# Altium project Power Converter 5V as TO-3 replacement.PrjPcb
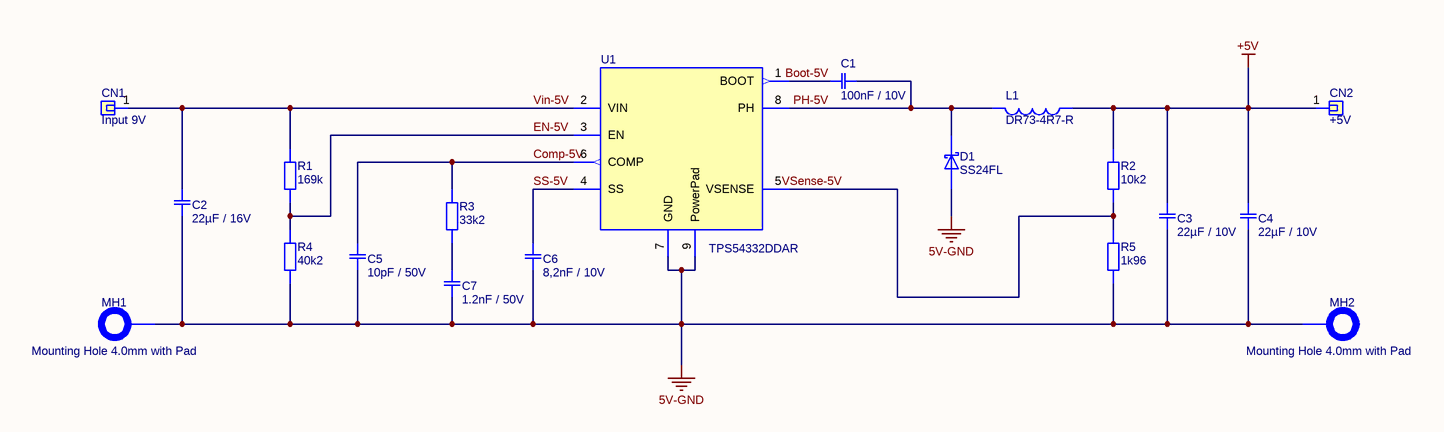
[diagram p0: Power Converter 5V as TO-3 replacement.SchDoc]
Author: PCB-Tech; Revision: A; Title: Projektname; Version: 1.0
1 sheet, 19 parts. Net scope: global (net labels, ports and power ports of the same name join across sheets).
Board file: Power Converter 5V as TO-3 replacement.PcbDoc

## Sheet Power Converter 5V as TO-3 replacement.SchDoc: Projektname
size 297 x 209 mm; ApprovedBy: .; CheckedBy: .; Author: DiWou; CompanyName: DL2DW; DrawnBy: DiWou; Engineer: .; Organization: DL2DW; DocumentNumber: 1; Revision: -; SheetNumber: 1; SheetTotal: 1; DrawnDate: 06.08.2020; EngrDate: .; ChkdDate: .; Title1: Power Converter 5V as TO-3 replacement; Title2: .; Title3: .; Desc1: Version 1.0; Desc2: .; ApprDate: .

### Parts
C1  100nF / 10V  [CAP CER SMD 0402 100nF 10V Murata GRM155R71A104KA01D]
C2  22µF / 16V  [CAP CER SMD 1210 22µF 16V Murata GRM32ER61C226ME20L]
C3  22µF / 10V  [CAP CER SMD 0805 22µF 10V Murata GRM21BR61A226ME44L]
C4  22µF / 10V  [CAP CER SMD 0805 22µF 10V Murata GRM21BR61A226ME44L]
C5  10pF / 50V  [CAP CER SMD 0805 10pF 50V Samsung CL21C100JBANNNC]
C6  8,2nF / 10V  [CAP CER SMD 0201 8,2nF 10V Murata GRM033R71A822KA01D]
C7  1.2nF / 50V  [CAP CER SMD 0805 1.2nF 50V Samsung CL21C122JBFNNNE]
CN1  Input 9V  [Printed Circuit Pin 1.02mm 3125-2-00-80-00-00-08-0]
CN2  +5V  [Printed Circuit Pin 1.02mm 3125-2-00-80-00-00-08-0]
D1  SS24FL  [SS24FL]
L1  DR73-4R7-R  [Inductor SMD 4.7µH Eatont DR73-4R7-R]
MH1  Mounting Hole 4.0mm with Pad  [Mounting Hole 4mm with Pad]  (no BOM)
MH2  Mounting Hole 4.0mm with Pad  [Mounting Hole 4mm with Pad]  (no BOM)
R1  169k  [RES SMD 0402 169k Vishay CRCW0402169KFKED]
R2  10k2  [RES SMD 0402 10k2 Vishay CRCW040210K2FKED]
R3  33k2  [RES SMD 0402 33k2 Vishay CRCW040233K2FKED]
R4  40k2  [RES SMD 0402 40k2 Vishay CRCW040240K2FKED]
R5  1k96  [RES SMD 0402 1k96 Vishay CRCW04021K96FKED]
U1  TPS54332DDAR  [DC-DC Converter (Buck) TPS54332DDAR SO-Power Pad]

### Nets
5V-GND: C2.1 C3.1 C4.1 C5.1 C6.1 C7.1 D1.2 MH1.1 MH2.1 R4.1 R5.1 U1.7(GND) U1.9(PowerPad)
+5V: C3.2 C4.2 CN2.1 L1.2 R2.2
Boot-5V: C1.1 U1.1(BOOT)
Comp-5V: C5.2 R3.2 U1.6(COMP)
EN-5V: R1.1 R4.2 U1.3(EN)
PH-5V: C1.2 D1.1 L1.1 U1.8(PH)
SS-5V: C6.2 U1.4(SS)
Vin-5V: C2.2 CN1.1 R1.2 U1.2(VIN)
VSense-5V: R2.1 R5.2 U1.5(VSENSE)
NetC7_2: C7.2 R3.1

### Notes on the sheet
- Drawn by:
- Date
- Size:
- A4
- Rev:
- Engr:
- Chkd:
- Appr:
- File:
- Document No:
- Print Date & Time:
- /
- Sheet
- of

### Library data of the parts
C1 = CMP-Capacitors-Ceramic_Capacitors-00034-2: CAP CER 0.1UF 10V X7R 0402; Tolerance: 10%; Dissipation Factor: 0.035%; Number of Pins: 2; Termination: SMD/SMT; REACH SVHC: No SVHC; Length: 1mm; Case Code (Metric): 1005; Dielectric: X7R; Capacitance: 100nF; Width: 0.02inch; Package Quantity: 1; Packaging: Tape and Reel; Height: 0.5mm; Thickness: 0.022inch; Max Operating Temperature: 125°C; Voltage: 10V; Voltage Rating (DC): 10V; Depth: 0.5mm; Case Code (Imperial): 0402; Radiation Hardening: No; Case/Package: 0402; Min Operating Temperature: -55°C; Voltage Rating: 10V; Mount: Surface Mount; Lead Free: Lead Free
C2 = CMP-Capacitors-Ceramic_Capacitors-00036-1: Ceramic capacitor SMD 1210 22 µF 16 V 20 %; Capacitance: 22uF; Tolerance: 20%; Dielectric: X5R; Width: 0.098inch; Mount: Surface Mount; Material: Ceramic; Package Quantity: 1000; Depth: 2.5mm; Voltage Rating (DC): 16V; Thickness: 0.106inch; Length: 3.2mm; Radiation Hardening: No; Voltage Rating: 16V; Termination: SMD/SMT; Case/Package: 1210; Lead Free: Lead Free; Height: 2.5mm; Min Operating Temperature: -55°C; Max Operating Temperature: 85°C; Voltage: 16V; Packaging: Tape and Reel; Case Code (Metric): 3225; Case Code (Imperial): 1210
C3 C4 = CMP-Capacitors-Ceramic_Capacitors-00038-1: Multilayer Ceramic Capacitors MLCC - SMD/SMT 0805 22uF 10volts X5R 20%; Dissipation Factor: 0.035%; Mount: Surface Mount; Package Quantity: 3000; Weight: 0.000335oz; Packaging: Tape and Reel; Voltage: 10V; Composition: Ceramic; Voltage Rating (DC): 10V; Depth: 1.25mm; Capacitance: 22uF; Max Operating Temperature: 85°C; Length: 2mm; Height: 1.25mm; Voltage Rating: 10V; Case/Package: 0805; Width: 1.25mm; Case Code (Imperial): 0805; Termination: SMD/SMT; Min Operating Temperature: -55°C; Dielectric: X5R; Thickness: 0.057inch; Case Code (Metric): 2012; Dielectric Material: Ceramic; Lead Free: Lead Free; Tolerance: 20%
C5 = CMP-Capacitors-Ceramic_Capacitors-00031-1: Cap Ceramic 10pF 50VDC C0G 5% SMD 0805 Paper T/R; Max Operating Temperature: 125°C; Radiation Hardening: No; Case/Package: 0805; Case Code (Metric): 2012; Mount: Surface Mount; Contact Plating: Tin; Tolerance: 5%; Depth: 1.25mm; Case Code (Imperial): 0805; Min Operating Temperature: -55°C; Thickness: 0.03inch; Package Quantity: 1; Height: 0.65mm; Length: 2mm; Voltage Rating: 50V; Capacitance: 10pF; Packaging: Tape and Reel; Dielectric: C0G; Width: 0.049inch
C6 = CMP-Capacitors-Ceramic_Capacitors-00033-1: Multilayer Ceramic Capacitors MLCC - SMD/SMT 0.0082uF 10volts 10%; Dielectric: X7R; Capacitance: 8.2nF; Tolerance: 10%; Thickness: 0.013inch; Height: 0.3mm; Max Operating Temperature: 125°C; Voltage Rating (DC): 10V; Voltage Rating: 10V; Package Quantity: 15000; Width: 0.012inch; Min Operating Temperature: -55°C; Case Code (Imperial): 0201; Packaging: Tape and Reel; Termination: SMD/SMT; Case Code (Metric): 0603; Length: 0.6mm; Mount: Surface Mount; Radiation Hardening: No; Depth: 0.3mm; Case/Package: 0201
C7 = CMP-Capacitors-Ceramic_Capacitors-00037-1: Ceramic capacitor SMD-0805 1.2nF /50V NP0# J +-5% SAMSUNG , RoHS; Tolerance: 5%; Voltage Rating: 50V; Lead Free: Lead Free; Width: 0.049inch; Capacitance: 1.2nF; Max Operating Temperature: 125°C; Case Code (Imperial): 0805; Packaging: Cut Tape; Thickness: 0.053inch; Mount: Surface Mount; Case/Package: 0805; Min Operating Temperature: -55°C; Case Code (Metric): 2012; Package Quantity: 1; Length: 0.079inch; Voltage Rating (DC): 50V
CN1 CN2 = CMP-Mechanicals-00020-1: CONN PC PIN CIRC 0.040DIA TIN; Gender: Male; Board Thickness: 0.062inch; Hole Diameter: 1.09mm; Insulation: Non-Insulated; Mounting Hole Diameter: 0.043inch; Outside Diameter: 1.8mm; Flange Diameter: 0.071inch; Plating: Tin; Packaging: Bulk; Termination: PC Pin; Contact Material: Brass; Mount: Through Hole; Contact Plating: Tin; Length: 0.402inch; Package Quantity: 500; Material: Brass
D1 = CMP-Diodes-00012-3: 40V, 2A SCHOTTKY IN SOD123F; Reverse Recovery Time: 9.495ns; Element Configuration: Single; Max Forward Surge Current (Ifsm): 50A; Case/Package: SOD; Mount: Surface Mount; Packaging: Tape and Reel; Weight: 0.0276g; Number of Pins: 2; Max Reverse Voltage (DC): 40V; Max Repetitive Reverse Voltage (Vrrm): 40V; Average Rectified Current: 2A
L1 = CMP-Inductors-00014-2: Ind Power Shielded Wirewound 4.7uH 20% 100KHz Ferrite 3.09A T/R; DC Resistance (DCR): 29.7mR; Saturation Current: 3.78A; RMS Current (Irms): 3.09A; Self Resonant Frequency: 100kHz; Shielding: Shielded; Core Material: Ferrite; REACH SVHC: No SVHC; Test Frequency: 100kHz; Depth: 7.6mm; Length: 7.6mm; Composition: Wirewound; Tolerance: 20%; Termination: SMD/SMT; Inductance Tolerance: 20%; Radiation Hardening: No; Case/Package: Nonstandard; Weight: 0.032oz; Current Rating: 3.09A; Package Quantity: 1350; Packaging: Tape and Reel; Lead Free: Lead Free; Min Operating Temperature: -40°C; Military Standard: Not; Max Operating Temperature: 125°C; Mount: Surface Mount; Height - Seated (Max): 0.139inch; Inductance: 4.7uH; Width: 6mm; Number of Pins: 2; Height: 3.55mm; Max DC Current: 3.09A
MH1 MH2 = CMP-Mechanicals-00019-2
R1 = CMP-Resistors-00008-1: VISHAY - CRCW0402169KFKED - RES, THICK FILM, 169K, 1%, 0.063W, 0402, REEL; Voltage Rating: 50V; Max Power Dissipation: 63mW; Temperature Coefficient: 100ppm/°C; Resistance: 169kR; Case Code (Metric): 1005; Mount: Surface Mount; Number of Pins: 2; Width: 0.02inch; Lead Free: Lead Free; Contact Plating: Tin; Depth: 0.5mm; Height: 0.35mm; Case/Package: 0402; Max Operating Temperature: 155°C; Power Rating: 63mW; Tolerance: 1%; Composition: Thick Film; Packaging: Tape and Reel; Min Operating Temperature: -55°C; Radiation Hardening: No; Military Standard: Not; Case Code (Imperial): 0402; Weight: 2.3E-05oz; REACH SVHC: Unknown; Voltage Rating (DC): 50V; Package Quantity: 10; Number of Terminations: 2; Features: Automotive AEC-Q200; Length: 1mm; Termination: SMD/SMT
R2 = CMP-Resistors-00024-1: VISHAY         CRCW040210K2FKED.            Surface Mount Chip Resistor, Thick Film, AEC-Q200 CRCW Series, 10.2 kohm, 63 mW,  1%, 50 V; Temperature Coefficient: 100ppm/°C; Resistance: 10.2kR; Power Rating: 63mW; Voltage Rating: 50V; Military Standard: Not; Depth: 0.5mm; Case Code (Imperial): 0402; Weight: 2.3E-05oz; Composition: Thick Film; Length: 1mm; Radiation Hardening: No; Features: Automotive AEC-Q200; Number of Pins: 2; Max Power Dissipation: 63mW; Contact Plating: Tin; REACH SVHC: Unknown; Max Operating Temperature: 155°C; Termination: SMD/SMT; Mount: Surface Mount; Number of Terminations: 2; Width: 0.5mm; Min Operating Temperature: -55°C; Package Quantity: 10; Tolerance: 1%; Case Code (Metric): 1005; Packaging: Tape and Reel; Height: 0.35mm; Case/Package: 0402
R3 = CMP-Resistors-00037-1: Res Thick Film 0402 33.2K Ohm 1% 1/16W 100ppm/C Molded SMD Paper T/R; Voltage Rating (DC): 50V; Resistance: 33.2kR; Power Rating: 63mW; Temperature Coefficient: 100ppm/°C; Width: 0.5mm; Case/Package: 0402; Max Operating Temperature: 155°C; Package Quantity: 10; Packaging: Tape and Reel; Radiation Hardening: No; Mount: Surface Mount; Voltage Rating: 50V; Contact Plating: Tin; Height: 0.35mm; Depth: 0.5mm; Min Operating Temperature: -55°C; Number of Terminations: 2; Case Code (Imperial): 0402; REACH SVHC: Unknown; Weight: 2.3E-05oz; Lead Free: Lead Free; Number of Pins: 2; Composition: Thick Film; Length: 1mm; Termination: SMD/SMT; Max Power Dissipation: 63mW; Case Code (Metric): 1005; Features: Automotive AEC-Q200; Military Standard: Not; Tolerance: 1%
R4 = CMP-Resistors-00036-1: Res Thick Film 0402 40.2K Ohm 1% 1/16W 100ppm/C Molded SMD SMD Paper T/R; Voltage Rating: 50V; Power Rating: 63mW; Temperature Coefficient: 100ppm/°C; Resistance: 40.2kR; Max Operating Temperature: 155°C; Packaging: Tape and Reel; Width: 0.5mm; Composition: Thick Film; Contact Plating: Tin; REACH SVHC: Unknown; Weight: 2.3E-05oz; Case Code (Imperial): 0402; Radiation Hardening: No; Case/Package: 0402; Min Operating Temperature: -55°C; Depth: 0.5mm; Features: Automotive AEC-Q200; Termination: SMD/SMT; Tolerance: 1%; Case Code (Metric): 1005; Length: 1mm; Lead Free: Lead Free; Voltage Rating (DC): 50V; Max Power Dissipation: 63mW; Number of Terminations: 2; Military Standard: Not; Package Quantity: 10; Height: 0.35mm
R5 = CMP-Resistors-00038-1: VISHAY         CRCW04021K96FKED             RES, THICK FILM, 1K96, 1%, 0.063W, 0402; Voltage Rating: 50V; Temperature Coefficient: 100ppm/°C; Power Rating: 63mW; Resistance: 1.96kR; Radiation Hardening: No; Packaging: Tape and Reel; Tolerance: 1%; Termination: SMD/SMT; Weight: 2.3E-05oz; Composition: Thick Film; Case Code (Metric): 1005; Height: 0.35mm; Case/Package: 0402; Package Quantity: 10; Number of Terminations: 2; Number of Pins: 2; Depth: 0.5mm; Max Power Dissipation: 63mW; Max Operating Temperature: 155°C; Case Code (Imperial): 0402; Features: Automotive AEC-Q200; Width: 0.5mm; Length: 1mm; Contact Plating: Tin; Military Standard: Not; Min Operating Temperature: -55°C; REACH SVHC: Unknown
U1 = CMP-ICs-Power_Supply-00013-5: TEXAS INSTRUMENTS - TPS54332DDAR - DC/DC CONV, BUCK, 1MHZ, SOIC-8; Quiescent Current: 82uA; Min Output Voltage: 800mV; Output Configuration: Positive; Synchronous Rectifier: No; Number of Outputs: 1; Output Type: Adjustable; Max Output Current: 3.5A; Max Output Voltage: 26.04V; Operating Supply Voltage: 28V; Min Supply Voltage: 3.5V; Output Voltage: 25V; Lead Free: Contains Lead; Length: 5mm; Max Operating Temperature: 150°C; Number of Pins: 8; REACH SVHC: No SVHC; Contact Plating: Gold; Package Quantity: 2500; Max Input Voltage: 28V; Output Current: 3.5A; Width: 4mm; Packaging: Tape and Reel; Mount: Surface Mount; Radiation Hardening: No; Min Operating Temperature: -40°C; Switching Frequency: 1MHz; Height: 1.55mm; Min Input Voltage: 3.5V; Weight: 0.00249oz